# Altium schematic sheet FPGAIO.SchDoc
size B
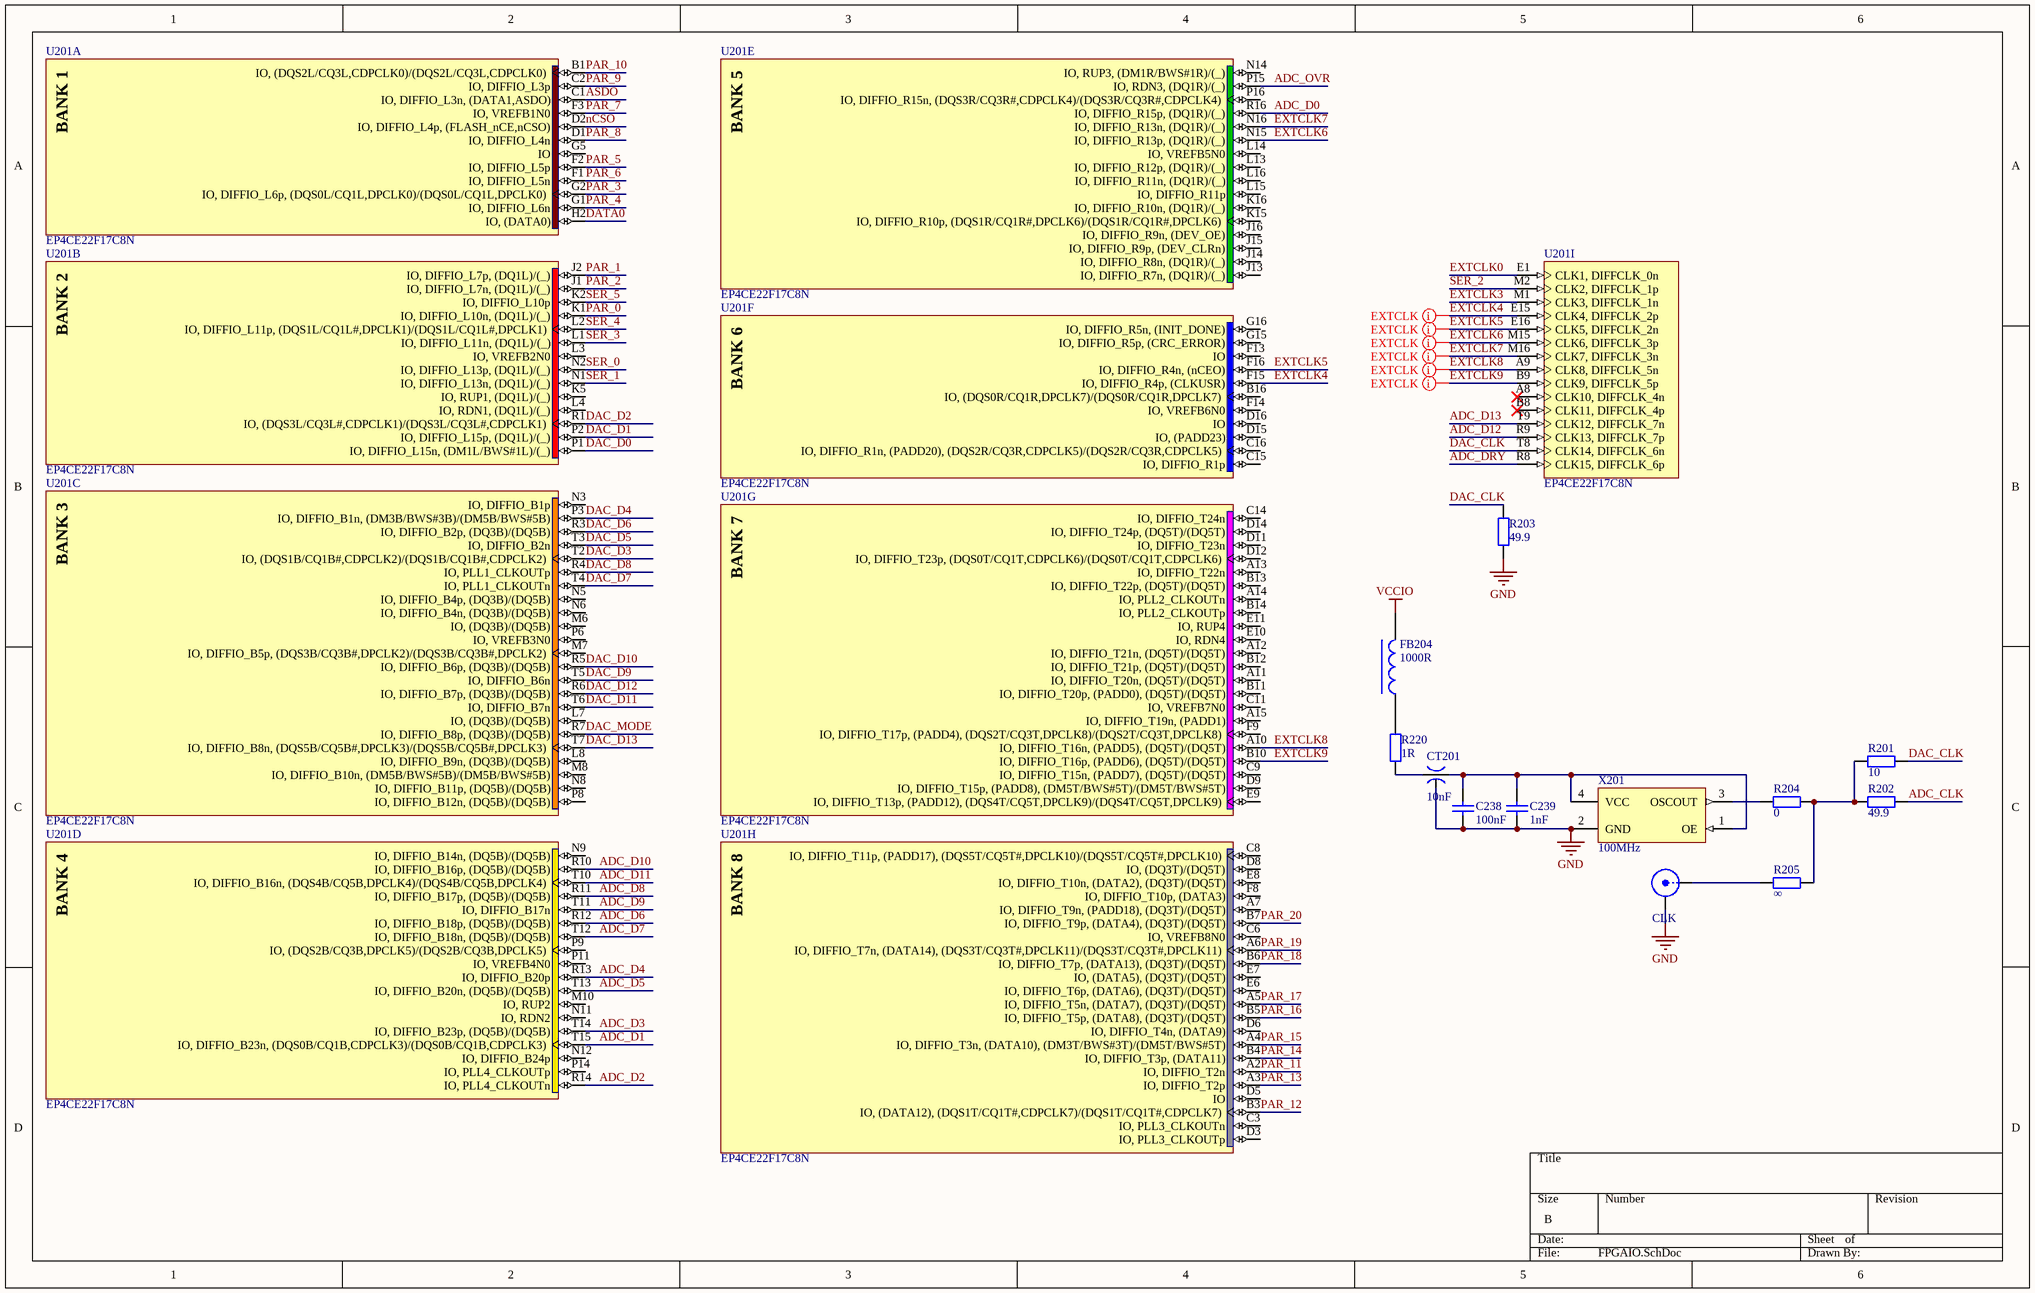
[diagram p0: FPGAIO.SchDoc]

## Parts
C238  value 100nF  [0402C]  (hidden comment: MLCC)
C239  value 1nF  [0402C]  (hidden comment: MLCC)
CLK  SMA  [SMA-V-NARROW]  (value not drawn)
CT201  value 10nF  [CAPC0603TH]  (hidden comment: CAP-TH)
FB204  value 1000R  [0603L]  (hidden comment: FerriteBead)
R201  value 10  [0402R]  (hidden comment: Resistor)
R202  value 49.9  [0402R]  (hidden comment: Resistor)
R203  value 49.9  [0402R]  (hidden comment: Resistor)
R204  value 0  [0402R]  (hidden comment: Resistor)
R205  value ∞  [0402R]  (hidden comment: Resistor)
R220  value 1R  [0603R]  (hidden comment: Resistor)
U201  EP4CE22F17C8N  [FBGA256_A-155]  (parts A,B,C,D,E,F,G,H,I of 13)
X201  value 100MHz  [XTAL-7050]  (hidden comment: Oscillator)

## Nets
GND: C238.1 C239.1 CLK.2(Y) CT201.3 R203.1 X201.2(GND)
VCCIO: FB204.2
ADC_CLK: R202.2
ADC_D0: U201.R16(IO,_DIFFIO_R15p,_(DQ1R)/(_))
ADC_D1: U201.T15(IO,_DIFFIO_B23n,_(DQS0B/CQ1B,CDPCLK3)/(DQS0B/CQ1B,CDPCLK3))
ADC_D2: U201.R14(IO,_PLL4_CLKOUTn)
ADC_D3: U201.T14(IO,_DIFFIO_B23p,_(DQ5B)/(DQ5B))
ADC_D4: U201.R13(IO,_DIFFIO_B20p)
ADC_D5: U201.T13(IO,_DIFFIO_B20n,_(DQ5B)/(DQ5B))
ADC_D6: U201.R12(IO,_DIFFIO_B18p,_(DQ5B)/(DQ5B))
ADC_D7: U201.T12(IO,_DIFFIO_B18n,_(DQ5B)/(DQ5B))
ADC_D8: U201.R11(IO,_DIFFIO_B17p,_(DQ5B)/(DQ5B))
ADC_D9: U201.T11(IO,_DIFFIO_B17n)
ADC_D10: U201.R10(IO,_DIFFIO_B16p,_(DQ5B)/(DQ5B))
ADC_D11: U201.T10(IO,_DIFFIO_B16n,_(DQS4B/CQ5B,DPCLK4)/(DQS4B/CQ5B,DPCLK4))
ADC_D12: U201.R9(CLK13,_DIFFCLK_7p)
ADC_D13: U201.T9(CLK12,_DIFFCLK_7n)
ADC_DRY: U201.R8(CLK15,_DIFFCLK_6p)
ADC_OVR: U201.P15(IO,_RDN3,_(DQ1R)/(_))
ASDO: U201.C1(IO,_DIFFIO_L3n,_(DATA1,ASDO))
DAC_CLK: R201.2 R203.2 U201.T8(CLK14,_DIFFCLK_6n)
DAC_D0: U201.P1(IO,_DIFFIO_L15n,_(DM1L/BWS#1L)/(_))
DAC_D1: U201.P2(IO,_DIFFIO_L15p,_(DQ1L)/(_))
DAC_D2: U201.R1(IO,_(DQS3L/CQ3L#,CDPCLK1)/(DQS3L/CQ3L#,CDPCLK1))
DAC_D3: U201.T2(IO,_(DQS1B/CQ1B#,CDPCLK2)/(DQS1B/CQ1B#,CDPCLK2))
DAC_D4: U201.P3(IO,_DIFFIO_B1n,_(DM3B/BWS#3B)/(DM5B/BWS#5B))
DAC_D5: U201.T3(IO,_DIFFIO_B2n)
DAC_D6: U201.R3(IO,_DIFFIO_B2p,_(DQ3B)/(DQ5B))
DAC_D7: U201.T4(IO,_PLL1_CLKOUTn)
DAC_D8: U201.R4(IO,_PLL1_CLKOUTp)
DAC_D9: U201.T5(IO,_DIFFIO_B6n)
DAC_D10: U201.R5(IO,_DIFFIO_B6p,_(DQ3B)/(DQ5B))
DAC_D11: U201.T6(IO,_DIFFIO_B7n)
DAC_D12: U201.R6(IO,_DIFFIO_B7p,_(DQ3B)/(DQ5B))
DAC_D13: U201.T7(IO,_DIFFIO_B8n,_(DQS5B/CQ5B#,DPCLK3)/(DQS5B/CQ5B#,DPCLK3))
DAC_MODE: U201.R7(IO,_DIFFIO_B8p,_(DQ3B)/(DQ5B))
DATA0: U201.H2(IO,_(DATA0))
EXTCLK0: U201.E1(CLK1,_DIFFCLK_0n)
EXTCLK3: U201.M1(CLK3,_DIFFCLK_1n)
EXTCLK4: U201.E15(CLK4,_DIFFCLK_2p) U201.F15(IO,_DIFFIO_R4p,_(CLKUSR))
EXTCLK5: U201.E16(CLK5,_DIFFCLK_2n) U201.F16(IO,_DIFFIO_R4n,_(nCEO))
EXTCLK6: U201.M15(CLK6,_DIFFCLK_3p) U201.N15(IO,_DIFFIO_R13p,_(DQ1R)/(_))
EXTCLK7: U201.M16(CLK7,_DIFFCLK_3n) U201.N16(IO,_DIFFIO_R13n,_(DQ1R)/(_))
EXTCLK8: U201.A9(CLK8,_DIFFCLK_5n) U201.A10(IO,_DIFFIO_T16n,_(PADD5),_(DQ5T)/(DQ5T))
EXTCLK9: U201.B9(CLK9,_DIFFCLK_5p) U201.B10(IO,_DIFFIO_T16p,_(PADD6),_(DQ5T)/(DQ5T))
nCSO: U201.D2(IO,_DIFFIO_L4p,_(FLASH_nCE,nCSO))
PAR_0: U201.K1(IO,_DIFFIO_L10n,_(DQ1L)/(_))
PAR_1: U201.J2(IO,_DIFFIO_L7p,_(DQ1L)/(_))
PAR_2: U201.J1(IO,_DIFFIO_L7n,_(DQ1L)/(_))
PAR_3: U201.G2(IO,_DIFFIO_L6p,_(DQS0L/CQ1L,DPCLK0)/(DQS0L/CQ1L,DPCLK0))
PAR_4: U201.G1(IO,_DIFFIO_L6n)
PAR_5: U201.F2(IO,_DIFFIO_L5p)
PAR_6: U201.F1(IO,_DIFFIO_L5n)
PAR_7: U201.F3(IO,_VREFB1N0)
PAR_8: U201.D1(IO,_DIFFIO_L4n)
PAR_9: U201.C2(IO,_DIFFIO_L3p)
PAR_10: U201.B1(IO,_(DQS2L/CQ3L,CDPCLK0)/(DQS2L/CQ3L,CDPCLK0))
PAR_11: U201.A2(IO,_DIFFIO_T2n)
PAR_12: U201.B3(IO,_(DATA12),_(DQS1T/CQ1T#,CDPCLK7)/(DQS1T/CQ1T#,CDPCLK7))
PAR_13: U201.A3(IO,_DIFFIO_T2p)
PAR_14: U201.B4(IO,_DIFFIO_T3p,_(DATA11))
PAR_15: U201.A4(IO,_DIFFIO_T3n,_(DATA10),_(DM3T/BWS#3T)/(DM5T/BWS#5T))
PAR_16: U201.B5(IO,_DIFFIO_T5p,_(DATA8),_(DQ3T)/(DQ5T))
PAR_17: U201.A5(IO,_DIFFIO_T5n,_(DATA7),_(DQ3T)/(DQ5T))
PAR_18: U201.B6(IO,_DIFFIO_T7p,_(DATA13),_(DQ3T)/(DQ5T))
PAR_19: U201.A6(IO,_DIFFIO_T7n,_(DATA14),_(DQS3T/CQ3T#,DPCLK11)/(DQS3T/CQ3T#,DPCLK11))
PAR_20: U201.B7(IO,_DIFFIO_T9p,_(DATA4),_(DQ3T)/(DQ5T))
SER_0: U201.N2(IO,_DIFFIO_L13p,_(DQ1L)/(_))
SER_1: U201.N1(IO,_DIFFIO_L13n,_(DQ1L)/(_))
SER_2: U201.M2(CLK2,_DIFFCLK_1p)
SER_3: U201.L1(IO,_DIFFIO_L11n,_(DQ1L)/(_))
SER_4: U201.L2(IO,_DIFFIO_L11p,_(DQS1L/CQ1L#,DPCLK1)/(DQS1L/CQ1L#,DPCLK1))
SER_5: U201.K2(IO,_DIFFIO_L10p)
NetC238_2: C238.2 C239.2 CT201.2 X201.1(OE) X201.4(VCC)
NetCLK_1: CLK.1(X) R205.1
NetCT201_1: CT201.1 R220.1
NetFB204_1: FB204.1 R220.2
NetR201_1: R201.1 R202.1 R204.2 R205.2
NetR204_1: R204.1 X201.3(OSCOUT)

Not connected (* = marked no-connect by the designer): U201 A7(IO,_DIFFIO_T9n,_(PADD18),_(DQ3T)/(DQ5T)) A8(CLK10,_DIFFCLK_4n)* A11(IO,_DIFFIO_T20n,_(DQ5T)/(DQ5T)) A12(IO,_DIFFIO_T21n,_(DQ5T)/(DQ5T)) A13(IO,_DIFFIO_T22n) A14(IO,_PLL2_CLKOUTn) A15(IO,_DIFFIO_T19n,_(PADD1)) B8(CLK11,_DIFFCLK_4p)* B11(IO,_DIFFIO_T20p,_(PADD0),_(DQ5T)/(DQ5T)) B12(IO,_DIFFIO_T21p,_(DQ5T)/(DQ5T)) B13(IO,_DIFFIO_T22p,_(DQ5T)/(DQ5T)) B14(IO,_PLL2_CLKOUTp) B16(IO,_(DQS0R/CQ1R,DPCLK7)/(DQS0R/CQ1R,DPCLK7)) C3(IO,_PLL3_CLKOUTn) C6(IO,_VREFB8N0) C8(IO,_DIFFIO_T11p,_(PADD17),_(DQS5T/CQ5T#,DPCLK10)/(DQS5T/CQ5T#,DPCLK10)) C9(IO,_DIFFIO_T15n,_(PADD7),_(DQ5T)/(DQ5T)) C11(IO,_VREFB7N0) C14(IO,_DIFFIO_T24n) C15(IO,_DIFFIO_R1p) C16(IO,_DIFFIO_R1n,_(PADD20),_(DQS2R/CQ3R,CDPCLK5)/(DQS2R/CQ3R,CDPCLK5)) D3(IO,_PLL3_CLKOUTp) D5(IO) D6(IO,_DIFFIO_T4n,_(DATA9)) D8(IO,_(DQ3T)/(DQ5T)) D9(IO,_DIFFIO_T15p,_(PADD8),_(DM5T/BWS#5T)/(DM5T/BWS#5T)) D11(IO,_DIFFIO_T23n) D12(IO,_DIFFIO_T23p,_(DQS0T/CQ1T,CDPCLK6)/(DQS0T/CQ1T,CDPCLK6)) D14(IO,_DIFFIO_T24p,_(DQ5T)/(DQ5T)) D15(IO,_(PADD23)) D16(IO) E6(IO,_DIFFIO_T6p,_(DATA6),_(DQ3T)/(DQ5T)) E7(IO,_(DATA5),_(DQ3T)/(DQ5T)) E8(IO,_DIFFIO_T10n,_(DATA2),_(DQ3T)/(DQ5T)) E9(IO,_DIFFIO_T13p,_(PADD12),_(DQS4T/CQ5T,DPCLK9)/(DQS4T/CQ5T,DPCLK9)) E10(IO,_RDN4) E11(IO,_RUP4) F8(IO,_DIFFIO_T10p,_(DATA3)) F9(IO,_DIFFIO_T17p,_(PADD4),_(DQS2T/CQ3T,DPCLK8)/(DQS2T/CQ3T,DPCLK8)) F13(IO) F14(IO,_VREFB6N0) G5(IO) G15(IO,_DIFFIO_R5p,_(CRC_ERROR)) G16(IO,_DIFFIO_R5n,_(INIT_DONE)) J13(IO,_DIFFIO_R7n,_(DQ1R)/(_)) J14(IO,_DIFFIO_R8n,_(DQ1R)/(_)) J15(IO,_DIFFIO_R9p,_(DEV_CLRn)) J16(IO,_DIFFIO_R9n,_(DEV_OE)) K5(IO,_RUP1,_(DQ1L)/(_)) K15(IO,_DIFFIO_R10p,_(DQS1R/CQ1R#,DPCLK6)/(DQS1R/CQ1R#,DPCLK6)) K16(IO,_DIFFIO_R10n,_(DQ1R)/(_)) L3(IO,_VREFB2N0) L4(IO,_RDN1,_(DQ1L)/(_)) L7(IO,_(DQ3B)/(DQ5B)) L8(IO,_DIFFIO_B9n,_(DQ3B)/(DQ5B)) L13(IO,_DIFFIO_R12p,_(DQ1R)/(_)) L14(IO,_VREFB5N0) L15(IO,_DIFFIO_R11p) L16(IO,_DIFFIO_R11n,_(DQ1R)/(_)) M6(IO,_(DQ3B)/(DQ5B)) M7(IO,_DIFFIO_B5p,_(DQS3B/CQ3B#,DPCLK2)/(DQS3B/CQ3B#,DPCLK2)) M8(IO,_DIFFIO_B10n,_(DM5B/BWS#5B)/(DM5B/BWS#5B)) M10(IO,_RUP2) N3(IO,_DIFFIO_B1p) N5(IO,_DIFFIO_B4p,_(DQ3B)/(DQ5B)) N6(IO,_DIFFIO_B4n,_(DQ3B)/(DQ5B)) N8(IO,_DIFFIO_B11p,_(DQ5B)/(DQ5B)) N9(IO,_DIFFIO_B14n,_(DQ5B)/(DQ5B)) N11(IO,_RDN2) N12(IO,_DIFFIO_B24p) N14(IO,_RUP3,_(DM1R/BWS#1R)/(_)) P6(IO,_VREFB3N0) P8(IO,_DIFFIO_B12n,_(DQ5B)/(DQ5B)) P9(IO,_(DQS2B/CQ3B,DPCLK5)/(DQS2B/CQ3B,DPCLK5)) P11(IO,_VREFB4N0) P14(IO,_PLL4_CLKOUTp) P16(IO,_DIFFIO_R15n,_(DQS3R/CQ3R#,CDPCLK4)/(DQS3R/CQ3R#,CDPCLK4))

## Layout directives
net class EXTCLK: EXTCLK4, EXTCLK5, EXTCLK6, EXTCLK7, EXTCLK8, EXTCLK9

## Notes on the sheet
- (in symbol EP4CE22F17C8N, part A) BANK 1
- (in symbol EP4CE22F17C8N, part B) BANK 2
- (in symbol EP4CE22F17C8N, part C) BANK 3
- (in symbol EP4CE22F17C8N, part D) BANK 4
- (in symbol EP4CE22F17C8N, part E) BANK 5
- (in symbol EP4CE22F17C8N, part F) BANK 6
- (in symbol EP4CE22F17C8N, part G) BANK 7
- (in symbol EP4CE22F17C8N, part H) BANK 8

## Library data of the parts
CLK = SMA: SMA Connector
CT201 = CAP-TH: 3-terminal capacitor
U201 = EP4CE22F17C8N: Cyclone IV Family FPGA, 1.2V Core, 153 I/O Pins, 4 PLLs, 256-Pin FBGA, Speed Grade 8, Commercial Grade, Pb-Free; Manufacturer: Altera; DatasheetVersion: ver1.6, Nov-2011; PackageVersion: ver2.0, Nov-2011; PackageReference: FBGA256_A-155; PackageDescription: 256-Pin FineLine Ball-Grid Array (FBGA) - Thin - Wire Bond - A:1.55; Code_JEDEC: MO-192-DAF-1; ComponentLink1Description: Manufacturer URL; ComponentLink1URL: http://www.altera.com/; ComponentLink2Description: Handbook; ComponentLink2URL: http://www.altera.com/literature/hb/cyclone-iv/cyclone4-handbook.pdf; ComponentLink3Description: Pinout; ComponentLink3URL: http://www.altera.com/literature/lit-dp.jsp?category=cyc%204&showspreadsheet=y; ComponentLink4Description: Package Specification; ComponentLink4URL: http://www.altera.com/devicepackaging/04R00230-03.pdf